# EAGLE design additive_vco_hagiwo (EAGLE 9.6.2)
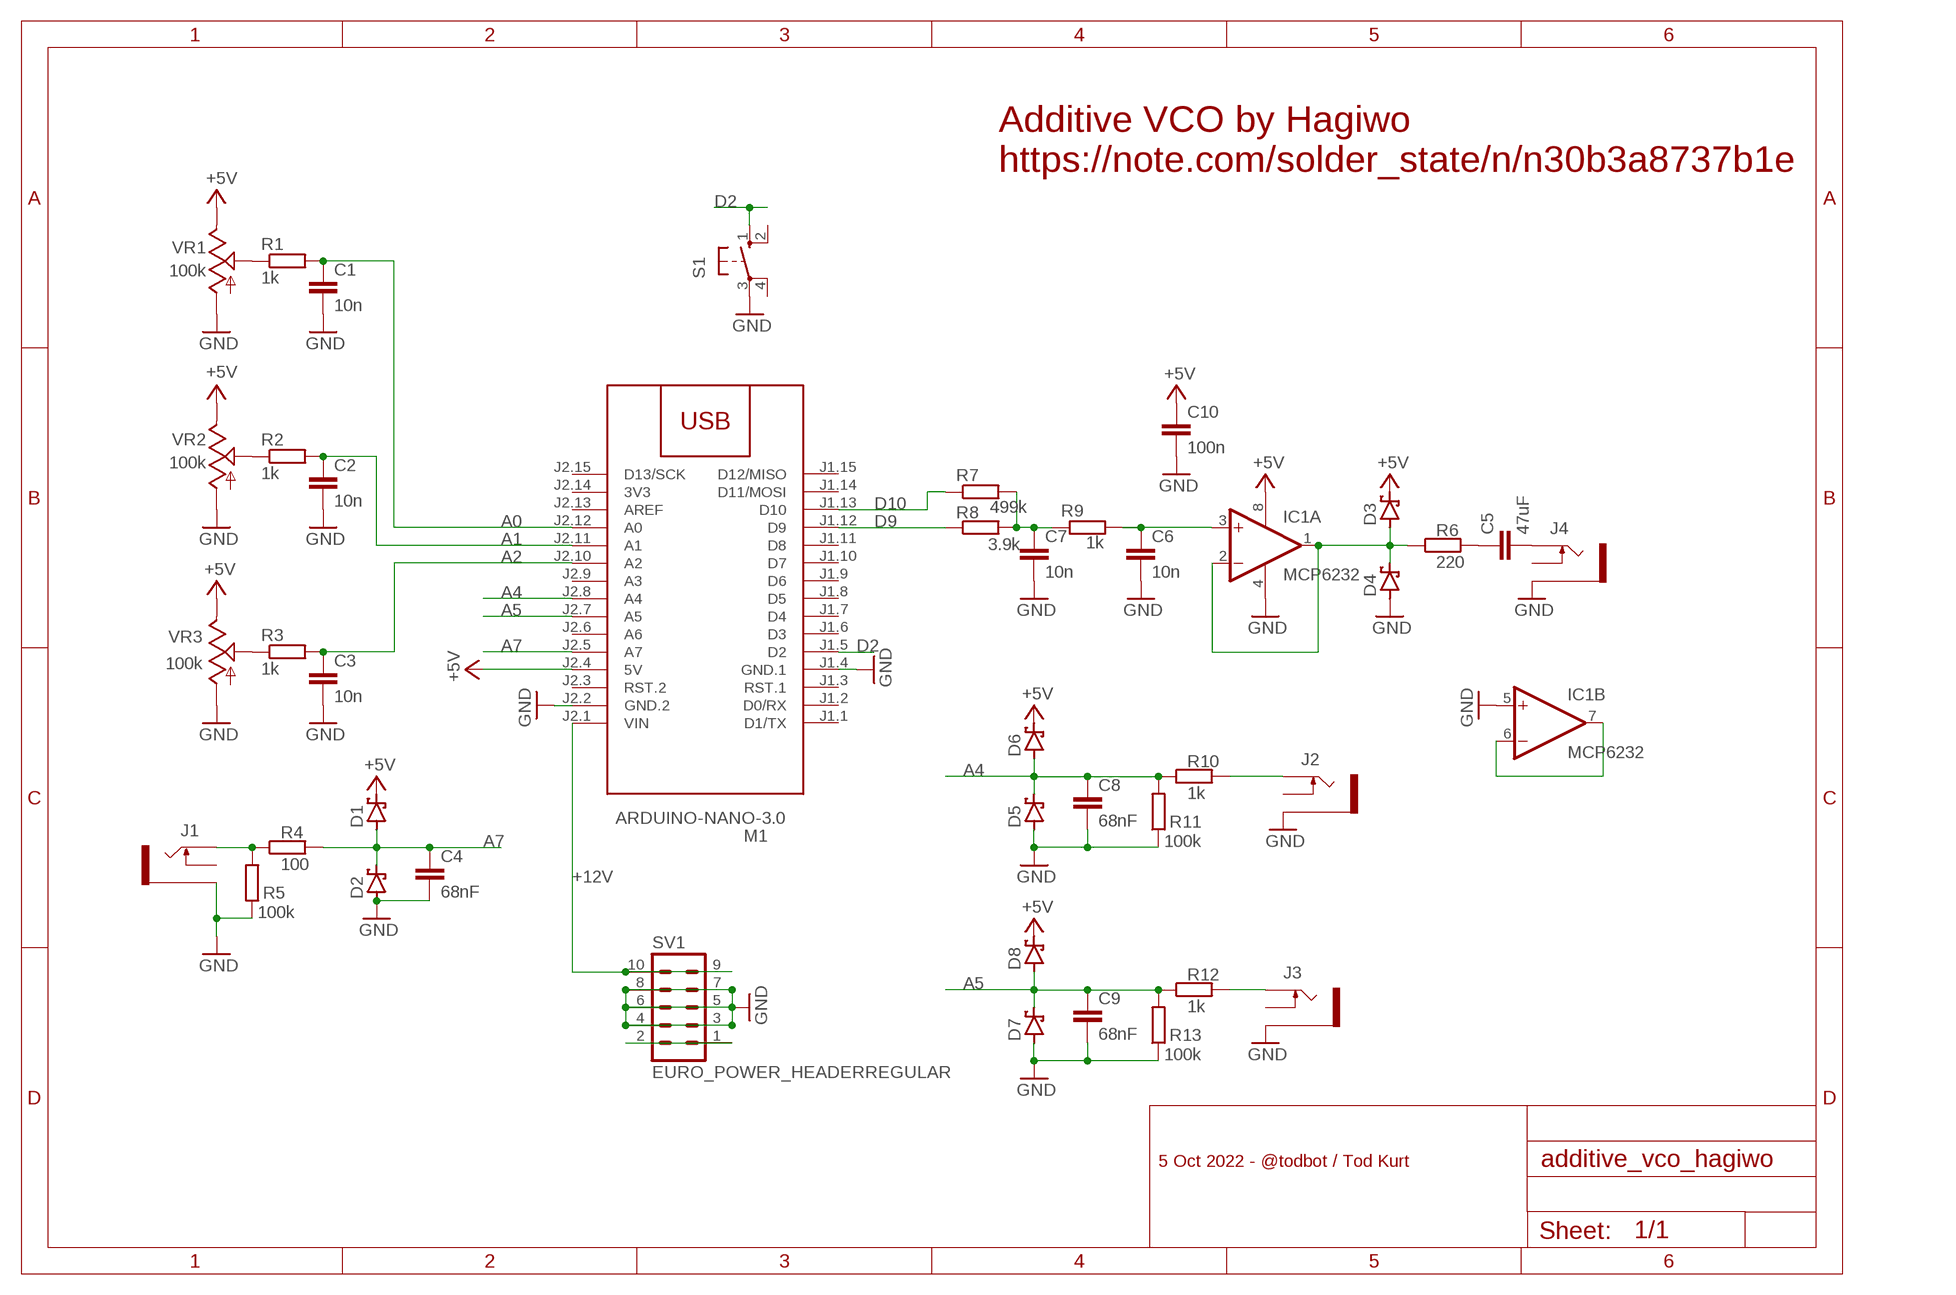
[diagram p0: schematic, sheet 1]

## Parts
C1  10n  C-EU025-025X050  [C025-025X050]
C2  10n  C-EU025-025X050  [C025-025X050]
C3  10n  C-EU025-025X050  [C025-025X050]
C4  68nF  C-EU025-025X050  [C025-025X050]
C5  47uF  C-EU025-025X050  [C025-025X050]
C6  10n  C-EU025-025X050  [C025-025X050]
C7  10n  C-EU025-025X050  [C025-025X050]
C8  68nF  C-EU025-025X050  [C025-025X050]
C9  68nF  C-EU025-025X050  [C025-025X050]
C10  100n  C-EU025-025X050  [C025-025X050]
D1  SCHOTTKY-DIODEDO35-7  [DO35-7]
D2  SCHOTTKY-DIODEDO35-7  [DO35-7]
D3  SCHOTTKY-DIODEDO35-7  [DO35-7]
D4  SCHOTTKY-DIODEDO35-7  [DO35-7]
D5  SCHOTTKY-DIODEDO35-7  [DO35-7]
D6  SCHOTTKY-DIODEDO35-7  [DO35-7]
D7  SCHOTTKY-DIODEDO35-7  [DO35-7]
D8  SCHOTTKY-DIODEDO35-7  [DO35-7]
IC1  MCP6232  MCP602P  [DIL08]
J1  THONKICONNNEW  [WQP-PJ301M-12_JACK]
J2  THONKICONNNEW  [WQP-PJ301M-12_JACK]
J3  THONKICONNNEW  [WQP-PJ301M-12_JACK]
J4  THONKICONNNEW  [WQP-PJ301M-12_JACK]
M1  ARDUINO-NANO-3.0  [ARDUINO-NANO-3.0]
R1  1k  R-EU_0204/2V  [0204V]
R2  1k  R-EU_0204/2V  [0204V]
R3  1k  R-EU_0204/2V  [0204V]
R4  100  R-EU_0204/5  [0204/5]
R5  100k  R-EU_0204/5  [0204/5]
R6  220  R-EU_0204/5  [0204/5]
R7  499k  R-EU_0204/2V  [0204V]
R8  3.9k  R-EU_0204/2V  [0204V]
R9  1k  R-EU_0204/2V  [0204V]
R10  1k  R-EU_0204/5  [0204/5]
R11  100k  R-EU_0204/5  [0204/5]
R12  1k  R-EU_0204/5  [0204/5]
R13  100k  R-EU_0204/5  [0204/5]
S1  10-XX  [B3F-10XX]
SV1  EURO_POWER_HEADERREGULAR  [EURO_POWER_HEADER]
VR1  100k  9MM_SNAP-IN_POT_  [9MM_SNAP-IN_POT]
VR2  100k  9MM_SNAP-IN_POT_  [9MM_SNAP-IN_POT]
VR3  100k  9MM_SNAP-IN_POT_  [9MM_SNAP-IN_POT]

## Nets
+5V: C10.1 D1.C D3.C D6.C D8.C IC1.8(P:V+) M1.J2.4(5V) VR1.3(E) VR2.3(E) VR3.3(E)
+12V: M1.J2.1(VIN) SV1.9 SV1.10
A0: C1.1 M1.J2.12(A0) R1.2
A1: C2.1 M1.J2.11(A1) R2.2
A2: C3.1 M1.J2.10(A2) R3.2
A4: C8.1 D5.C D6.A M1.J2.8(A4) R10.1 R11.2
A5: C9.1 D7.C D8.A M1.J2.7(A5) R12.1 R13.2
A7: C4.1 D1.A D2.C M1.J2.5(A7) R4.2
D2: M1.J1.5(D2) S1.1(S)
D9: M1.J1.12(D9) R8.1
D10: M1.J1.13(D10) R7.1
GND: C1.2 C2.2 C3.2 C4.2 C6.2 C7.2 C8.2 C9.2 C10.2 D2.A D4.A D5.A D7.A IC1.4(P:V-) IC1.5(B:+IN) J1.P$3_SLEEVE(SLEEVE) J2.P$3_SLEEVE(SLEEVE) J3.P$3_SLEEVE(SLEEVE) J4.P$3_SLEEVE(SLEEVE) M1.J1.4(GND.1) M1.J2.2(GND.2) R5.1 R11.1 R13.1 S1.3(P) SV1.3 SV1.4 SV1.5 SV1.6 SV1.7 SV1.8 VR1.1(A) VR2.1(A) VR3.1(A)
N$1: R1.1 VR1.2(S)
N$2: R2.1 VR2.2(S)
N$3: R3.1 VR3.2(S)
N$4: C5.1 R6.2
N$5: C5.2 J4.P$1_TIP(TIP)
N$6: D3.A D4.C IC1.1(A:OUT) IC1.2(A:-IN) R6.1
N$7: J1.P$1_TIP(TIP) R4.1 R5.2
N$8: C6.1 IC1.3(A:+IN) R9.2
N$9: C7.1 R7.2 R8.2 R9.1
N$10: SV1.1 SV1.2
N$11: J2.P$1_TIP(TIP) R10.2
N$12: IC1.6(B:-IN) IC1.7(B:OUT)
N$13: J3.P$1_TIP(TIP) R12.2
Unconnected: J1.P$2_SWITCH(SWITCH) J2.P$2_SWITCH(SWITCH) J3.P$2_SWITCH(SWITCH) J4.P$2_SWITCH(SWITCH) M1.J1.1(D1/TX) M1.J1.2(D0/RX) M1.J1.3(RST.1) M1.J1.6(D3) M1.J1.7(D4) M1.J1.8(D5) M1.J1.9(D6) M1.J1.10(D7) M1.J1.11(D8) M1.J1.14(D11/MOSI) M1.J1.15(D12/MISO) M1.J2.3(RST.2) M1.J2.6(A6) M1.J2.9(A3) M1.J2.13(AREF) M1.J2.15(D13/SCK) S1.2(S1) S1.4(P1)

## Notes on the sheet
- Additive VCO by Hagiwo
  https://note.com/solder_state/n/n30b3a8737b1e
- 5 Oct 2022 - @todbot / Tod Kurt

## Power pins joined to a net without a drawn wire
3V3: M1.J2.14(3V3)

## Library data of the parts
C1-C10 = rcl:C-EU: CAPACITOR, European symbol; SPICEPREFIX: C
D1-D8 = diode:SCHOTTKY-DIODE: Schottky Diode
IC1 = linear:MCP602: Single Op Amp 2.7V to 6.0V Single Supply CMOS Source: http://ww1.microchip.com/downloads/en/DeviceDoc/21314g.pdf
J1-J4 = MusicThingModular:THONKICONN: 3.5mm socket for Eurorack modular synths
M1 = diy-modules:ARDUINO-NANO-3.0: Arduino Nano 3.0 and compatible devices More details available here: https://www.arduino.cc/en/Main/ArduinoBoardNano Click here to find device on ebay.com <http://www.ebay.com/sch/arduino+nano>
R1-R13 = rcl:R-EU_: RESISTOR, European symbol; SPICEPREFIX: R
S1 = switch-omron:10-XX: OMRON SWITCH; MPN: B3F-1000; OC_FARNELL: 176432; OC_NEWARK: 36M3542
SV1 = MusicThingModular:EURO_POWER_HEADER: Power Header 10 pin power header for Eurorack Power Supplies Variants with fatter pads for easier soldering, and the LOCK variant which has 5mil offset pins to hold the component in place before soldering
VR1-VR3 = MusicThingModular:9MM_SNAP-IN_POT: 9mm vertical snap-in pot, Alpha / Panasonic style

## Board
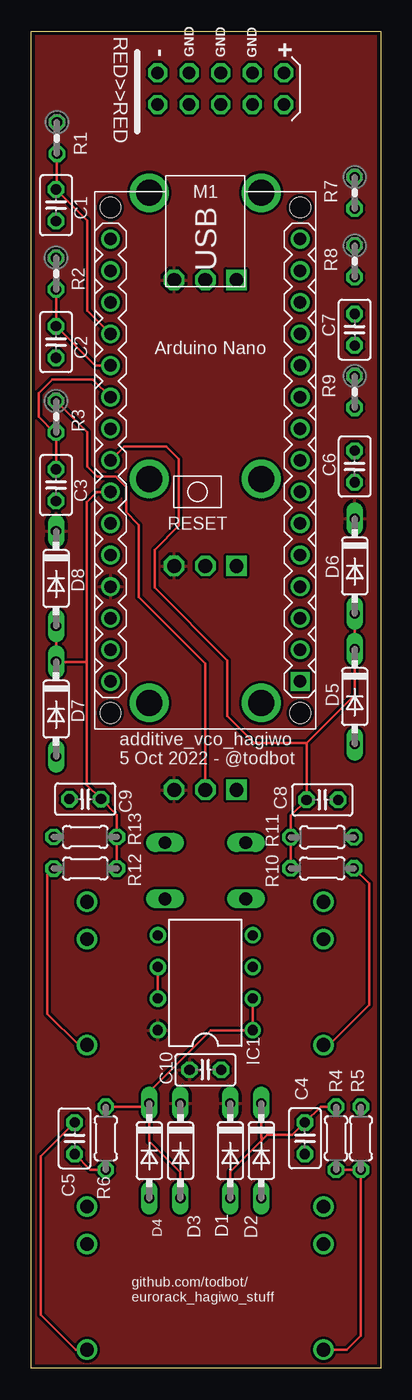
[diagram p1: board, top side]
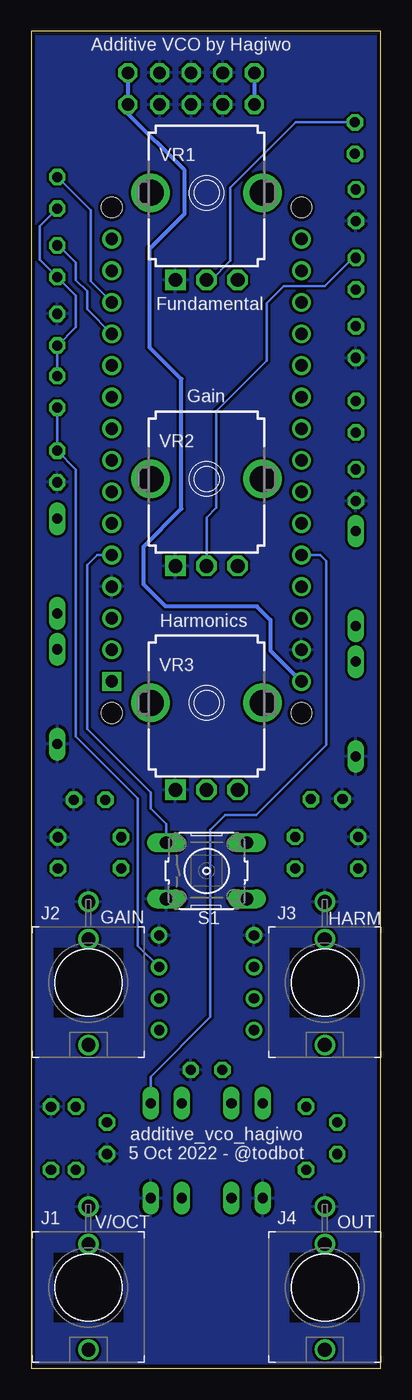
[diagram p2: board, bottom side, seen from below]

Size 28.1 x 107.5 mm. Coordinates in mm from the lower left corner, seen from the top.
Outline: 0,0 0,107.5 28.1,107.5 28.1,0 0,0
Copper layers (1*16): Top 0.035mm / dielectric 1.5mm / Bottom 0.035mm
Design rules "adafruit-rules-20180530": minimum track width 8mil, minimum drill 16mil, track to track 8mil, track to pad 8mil, pad to pad 8mil, via to via 8mil, smd to smd 8mil, copper to edge 10mil, drill to drill 8mil, minimum pad ring 10mil, minimum via ring 8mil, stop-mask expansion 4mil, vias tented up to drill 20mil, thermal gap 10mil

### Footprints (pad centres in the part's own frame; a part is rotated, then mirrored left to right if it is on the bottom)
C025-025X050 = drill 0.813 octagon: 1 -1.27,0; 2 1.27,0
DO35-7 = drill 0.813 long: A 3.81,0; C -3.81,0
DIL08 = drill 0.813 pad 1.27: 1 -3.81,-3.81; 2 -1.27,-3.81; 3 1.27,-3.81; 4 3.81,-3.81; 5 3.81,3.81; 6 1.27,3.81; 7 -1.27,3.81; 8 -3.81,3.81
WQP-PJ301M-12_JACK = drill 1.1: P$1_TIP 0,5; P$2_SWITCH 0,-3.5; P$3_SLEEVE 0,-6.5
ARDUINO-NANO-3.0 = drill 1 square: J1.1 17.78,7.62 | drill 1: J1.2 15.24,7.62; J1.3 12.7,7.62; J1.4 10.16,7.62; J1.5 7.62,7.62; J1.6 5.08,7.62; J1.7 2.54,7.62; J1.8 0,7.62; J1.9 -2.54,7.62; J1.10 -5.08,7.62; J1.11 -7.62,7.62; J1.12 -10.16,7.62; J1.13 -12.7,7.62; J1.14 -15.24,7.62; J1.15 -17.78,7.62; J2.1 17.78,-7.62; J2.2 15.24,-7.62; J2.3 12.7,-7.62; J2.4 10.16,-7.62; J2.5 7.62,-7.62; J2.6 5.08,-7.62; J2.7 2.54,-7.62; J2.8 0,-7.62; J2.9 -2.54,-7.62; J2.10 -5.08,-7.62; J2.11 -7.62,-7.62; J2.12 -10.16,-7.62; J2.13 -12.7,-7.62; J2.14 -15.24,-7.62; J2.15 -17.78,-7.62 | hole 1.651: -20.32,7.62; -20.32,-7.62; 20.32,-7.62; 20.32,7.62
0204V = drill 0.813 octagon: 1 -1.27,0; 2 1.27,0
0204/5 = drill 0.813 octagon: 1 -2.54,0; 2 2.54,0
B3F-10XX = drill 1.016 long: 1 -3.251,2.261; 2 3.251,2.261; 3 -3.251,-2.261; 4 3.251,-2.261
EURO_POWER_HEADER = drill 1.016 octagon: 1 -5.08,-1.27; 2 -5.08,1.27; 3 -2.54,-1.27; 4 -2.54,1.27; 5 0,-1.27; 6 0,1.27; 7 2.54,-1.27; 8 2.54,1.27; 9 5.08,-1.27; 10 5.08,1.27
9MM_SNAP-IN_POT = drill 1.1 square: 1 -2.5,-7 | drill 1.1 octagon: 2 0,-7; 3 2.5,-7 | drill 2.1 pad 2.794: CHASSIS1 -4.5,0; CHASSIS2 4.5,0

### Placement (x,y rotation side)
C1  2,93.5 270 top
C2  2,82.5 270 top
C3  2,71 270 top
C4  22,18.5 270 top
C5  3.5,18.5 90 top
C6  26,72.5 270 top
C7  26,83.5 90 top
C8  23.4,45.7 0 top
C9  4.35,45.76 180 top
C10  14,24 0 top
D1  16,17.5 270 top
D2  18.5,17.5 270 top
D3  12,17.5 270 top
D4  9.5,17.5 270 top
D5  26,54 270 top
D6  26,64.5 270 top
D7  2,53 270 top
D8  2,63.5 270 top
IC1  14,31 90 top
J1  23.5,6.5 180 bottom
J2  23.5,31 180 bottom
J3  4.5,31 180 bottom
J4  4.5,6.5 180 bottom
M1  14,73 270 top
R1  2.08,98.9 270 top
R2  2,88 270 top
R3  2,76.5 270 top
R4  24.5,18.5 90 top
R5  26.5,18.5 270 top
R6  6,18.5 270 top
R7  26,94.5 270 top
R8  26,89 270 top
R9  26,78.5 270 top
R10  23.4,40.2 0 top
R11  23.4,42.7 180 top
R12  4.35,40.18 180 top
R13  4.35,42.72 0 top
S1  14,40 0 bottom
SV1  15.24,102.87 0 top
VR1  14,94.5 0 bottom
VR2  14,71.5 0 bottom
VR3  14,53.5 0 bottom

### Tracks (layer width: path | path; a pad name or v marks a point on that pad's centre or on a via)
+5V
  pour Top: -1.27,107.95 30.48,107.95 30.48,-0.23 -1.27,-0.23
+12V
  Bottom 0.305: SV1.10 SV1.9 20.32,100.86 15.77,96.31 15.77,92.82 18.57,90.01 18.57,82.07 16.03,79.53 16.03,69.1 19.07,66.06 19.07,63.02 17.3,61.25 9.95,61.25 8.88,60.17 8.88,57.72 M1.J2.1
A0
  Top 0.203: R1.2 2.08,94.85 C1.1 4.5,92.27 4.5,85.04 M1.J2.12
A1
  Top 0.203: R2.2 C2.1 5.15,80.62 M1.J2.11
A2
  Top 0.203: C3.1 R3.2 1.87,75.23 0.6,76.5 0.6,78.4 1.7,79.5 4.96,79.5 M1.J2.10
A4
  Top 0.203: R10.1 R11.2 20.86,44.43 C8.1 22.13,50.27 | M1.J2.8 7.48,74.1 10.87,74.1 11.87,73.1 11.87,67.75 9.92,65.8 9.92,62.76 15.77,56.91 15.77,52.43 17.93,50.27 22.13,50.27 | D6.A D5.C 26,54.14 22.13,50.27
A5
  Top 0.203: R12.1 R13.2 6.89,44.49 C9.1 4.47,46.91 4.47,56.8 | M1.J2.7 5.28,70.46 4.47,69.65 4.47,56.8 | D8.A D7.C 4.47,56.8
A7
  Top 0.203: D2.C 18.5,18.59 18.55,18.59 18.55,18.34 | D1.A 16,15.79 18.55,18.34 | 18.55,18.34 18.98,18.77 21,18.77 C4.1 23.27,21.04 R4.2
  Bottom 0.203: D2.C 18.5,23.45 13.7,28.25 13.7,43.3 12.5,44.5 10,44.5 4.38,50.12 4.38,64.88 4.88,65.38 M1.J2.5
D2
  Bottom 0.203: M1.J1.5 22.8,65.38 23.6,64.58 23.6,51.39 18.5,46.29 18.5,45 17.25,43.75 S1.1
D9
  Bottom 0.203: R8.1 25.87,90.27 24.5,88.9 24.5,87.5 23.6,86.6 23.6,85.14 M1.J1.12
D10
  Bottom 0.203: M1.J1.13 23.32,87.4 23.32,93.12 25.97,95.77 R7.1
GND
  pour Bottom: -0.27,107.95 28.48,107.95 28.48,-0.23 -0.27,-0.23
N$1
  Bottom 0.203: R1.1 6.83,100.17 12.1,94.9 12.1,89.03 13.63,87.5 VR1.2
N$2
  Bottom 0.203: VR2.2 14,68.41 13.21,69.2 13.21,76.96 9.16,81.01 9.16,85.64 7.8,87 4.5,87 2.23,89.27 R2.1
N$3
  Top 0.203: VR3.2 14,56.67 8.66,62.01 8.66,67.81 7.64,68.83 7.64,70.86 6.8,71.7 5.3,71.7 4.5,72.5 4.5,75.27 R3.1
N$4
  Top 0.203: C5.1 4.77,15.96 R6.2
N$5
  Top 0.203: C5.2 0.77,17.04 0.77,4.31 3.58,1.5 J4.P$1_TIP
N$6
  Top 0.203: D4.C 9.23,21.04 R6.1 | D4.C 9.5,18.24 12,15.74 D3.A | IC1.2 IC1.1 14.44,27.19 9.5,22.25 D4.C
N$7
  Top 0.203: R4.1 R5.2 26.5,2.62 25.38,1.5 J1.P$1_TIP
N$8
  Bottom 0.203: IC1.3 19.52,33.98 19.52,45.83 24.5,50.81 24.5,72.27 C6.1 R9.2
N$9
  Bottom 0.203: R9.1 C7.1 25.97,82.23 24.5,83.7 24.5,86.23 R8.2 27.4,89.13 27.4,91.83 R7.2
N$10
  Bottom 0.305: SV1.2 SV1.1
N$11
  Top 0.203: J2.P$1_TIP 23.96,26 27.17,29.21 27.17,38.97 R10.2
N$12
  Top 0.203: IC1.6 IC1.7
N$13
  Top 0.203: R12.2 1.31,39.68 1.31,28.5 3.81,26 J3.P$1_TIP

### Text on the board
tPlace: Arduino Nano | additive_vco_hagiwo / 5 Oct 2022 - @todbot | github.com/todbot/ / eurorack_hagiwo_stuff
bPlace: Additive VCO by Hagiwo | Fundamental | Gain | Harmonics | HARM | GAIN | additive_vco_hagiwo / 5 Oct 2022 - @todbot | OUT | V/OCT